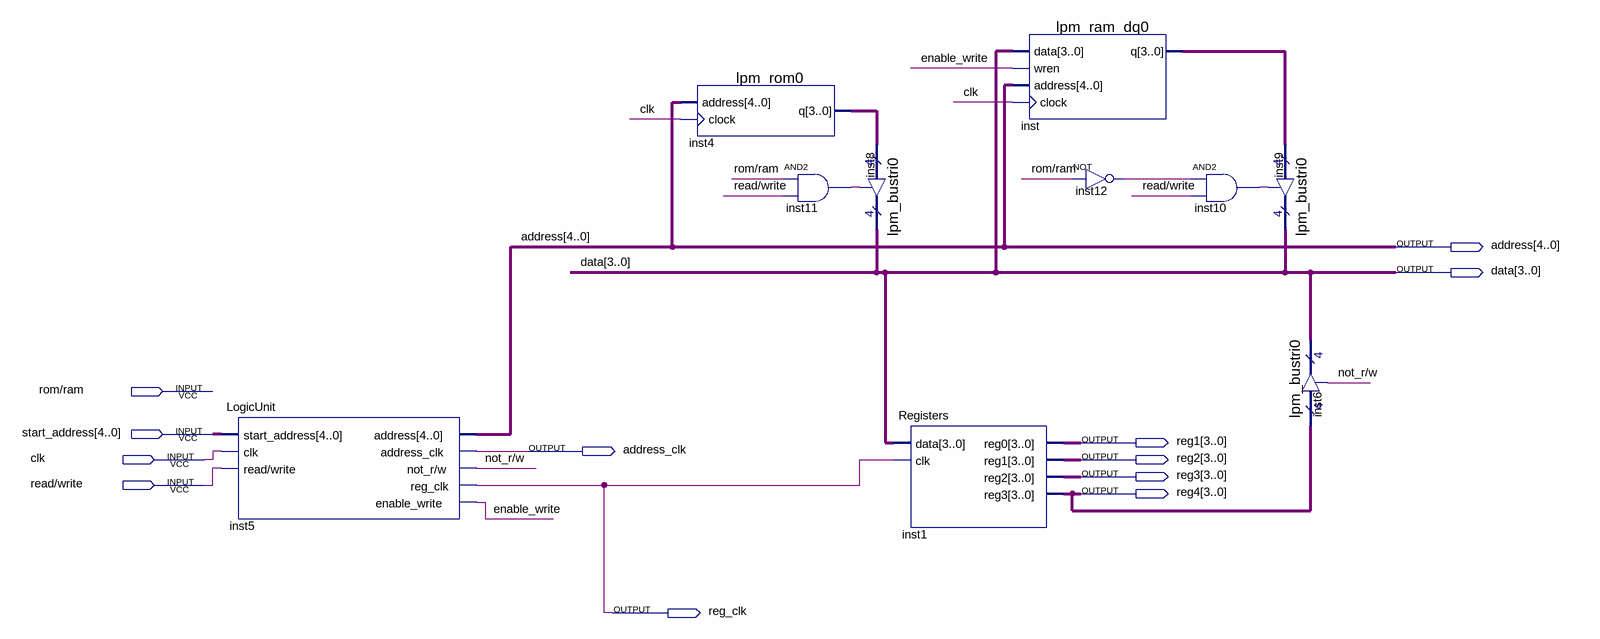
[diagram p0: schematic sheet]
// Quartus schematic Main.bdf as structural Verilog: 10 symbols, 12 pins
module Main (
  input  \rom/ram ,
  input  [4:0] start_address,
  input  clk,
  input  \read/write ,
  output [4:0] address,
  output [3:0] data,
  output [3:0] reg1,
  output address_clk,
  output [3:0] reg2,
  output [3:0] reg3,
  output [3:0] reg4,
  output reg_clk
);

  wire enable_write, inst10_out, inst11_out, inst12_out, \not_r/w ;
  wire [3:0] inst4_q, inst_q;

  LogicUnit inst5 (
    .start_address(start_address), .clk(clk), .\read/write (\read/write ), .address(address),
    .address_clk(address_clk), .\not_r/w (\not_r/w ), .reg_clk(reg_clk), .enable_write(enable_write));
  lpm_rom0 inst4 (.address(address), .clock(clk), .q(inst4_q));
  and inst11 (inst11_out, \rom/ram , \read/write );
  lpm_bustri0 inst8 (.enabledt(inst11_out), .data(inst4_q), .tridata(data));
  Registers inst1 (.data(data), .clk(reg_clk), .reg0(reg1), .reg1(reg2), .reg2(reg3), .reg3(reg4));
  lpm_ram_dq0 inst (.data(data), .wren(enable_write), .address(address), .clock(clk), .q(inst_q));
  not inst12 (inst12_out, \rom/ram );
  and inst10 (inst10_out, inst12_out, \read/write );
  lpm_bustri0 inst9 (.enabledt(inst10_out), .data(inst_q), .tridata(data));
  lpm_bustri0 inst6 (.enabledt(\not_r/w ), .data(reg4), .tridata(data));
endmodule
